# Altium project CM5IO_IARC.PrjPcb
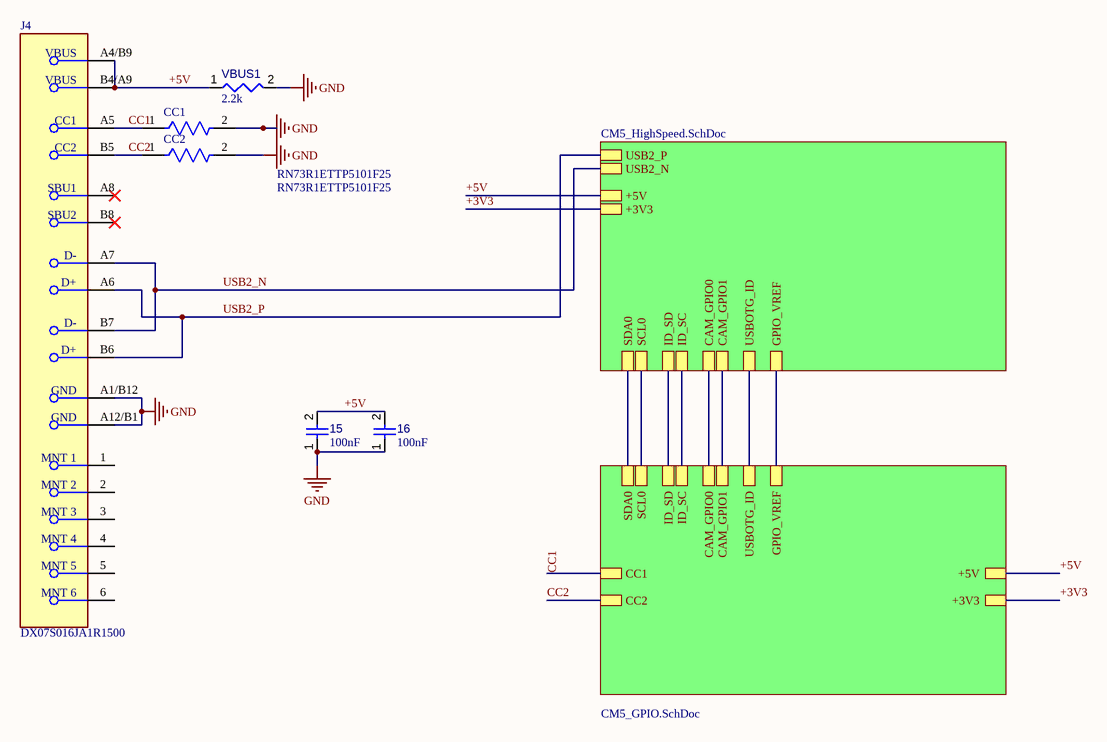
[diagram p0: Top.SchDoc]
3 sheets, 55 parts. Net scope: hierarchical (ports join the sheet entries above them; power ports are global).
Board file: CM5IO_IARC.PcbDoc
Sheets:
  Top.SchDoc
     = CM5_GPIO.SchDoc
     = CM5_HighSpeed.SchDoc

## Sheet Top.SchDoc
size A4; SheetNumber: 1; SheetTotal: 3

### Parts
15  value 100nF  [CAPC0402(1005)60_L]  (hidden comment: Capacitor 100nF +/-20% 50V 0402)
16  value 100nF  [CAPC0402(1005)60_L]  (hidden comment: Capacitor 100nF +/-20% 50V 0402)
CC1  RN73R1ETTP5101F25  [FP-RN73R1E-IPC_C]
CC2  RN73R1ETTP5101F25  [FP-RN73R1E-IPC_C]
J4  DX07S016JA1R1500  [FP-DX07S016JA1R1500-MFG]
VBUS1  value 2.2k  [RESC0402(1005)_L]  (hidden comment: 2D2KR2J)

### Sub-sheets
? = CM5_GPIO.SchDoc: SDA0, SCL0, ID_SD, ID_SC, CAM_GPIO0, CAM_GPIO1, USBOTG_ID, GPIO_VREF, +5V, +3V3, CC1, CC2
? = CM5_HighSpeed.SchDoc: USB2_P, USB2_N, +5V, +3V3, SDA0, SCL0, ID_SD, CAM_GPIO0, ID_SC, CAM_GPIO1, USBOTG_ID, GPIO_VREF

### Nets
GND: 15.1 16.1 CC1.2 CC2.2 J4.A1/B12(GND) J4.A12/B1(GND) VBUS1.2
+3V3: sheet /+3V3, sheet /+3V3
+5V: 15.2 16.2 J4.A4/B9(VBUS) J4.B4/A9(VBUS) VBUS1.1 ; sheet /+5V, sheet /+5V
CAM_GPIO0: sheet /CAM_GPIO0, sheet /CAM_GPIO0
CAM_GPIO1: sheet /CAM_GPIO1, sheet /CAM_GPIO1
CC1: CC1.1 J4.A5(CC1) ; sheet /CC1
CC2: CC2.1 J4.B5(CC2) ; sheet /CC2
GPIO_VREF: sheet /GPIO_VREF, sheet /GPIO_VREF
ID_SC: sheet /ID_SC, sheet /ID_SC
ID_SD: sheet /ID_SD, sheet /ID_SD
SCL0: sheet /SCL0, sheet /SCL0
SDA0: sheet /SDA0, sheet /SDA0
USB2_N: J4.A7(D-) J4.B7(D-) ; sheet /USB2_N
USB2_P: J4.A6(D+) J4.B6(D+) ; sheet /USB2_P
USBOTG_ID: sheet /USBOTG_ID, sheet /USBOTG_ID

Not connected (* = marked no-connect by the designer): J4 1(MNT_1) 2(MNT_2) 3(MNT_3) 4(MNT_4) 5(MNT_5) 6(MNT_6) A8(SBU1)* B8(SBU2)*

### Library data of the parts
15 16 = CMP-001-00067-3: Chip Capacitor, 100nF +/-20%, 50V, 0402, Thickness 0.6 mm; Tolerance: 10%; Min Operating Temperature: -55°C; Pins: 2; Case/Package: 0402; Max Operating Temperature: 85°C; Voltage Rating: 50V; Mounting Technology: SMT
CC1 CC2 = CMP-04015-008529-1: 5.1kΩ ±1% 0.063W, 1/16W Chip Resistor 0402 (1005 Metric) Moisture Resistant Thin Film
J4 = CMP-19038-000003-1: CONN RCP USB2.0 TYP C 24P SMD RA
VBUS1 = CMP-009-00087-2: 2K2 0.063W 5% 0402 (1005 Metric)  SMD; Power: 63mW; Mounting Technology: SMT; Tolerance: 5%; Case/Package: 0402; Pins: 2

## Sheet CM5_GPIO.SchDoc
size A4; SheetNumber: 2; SheetTotal: 3
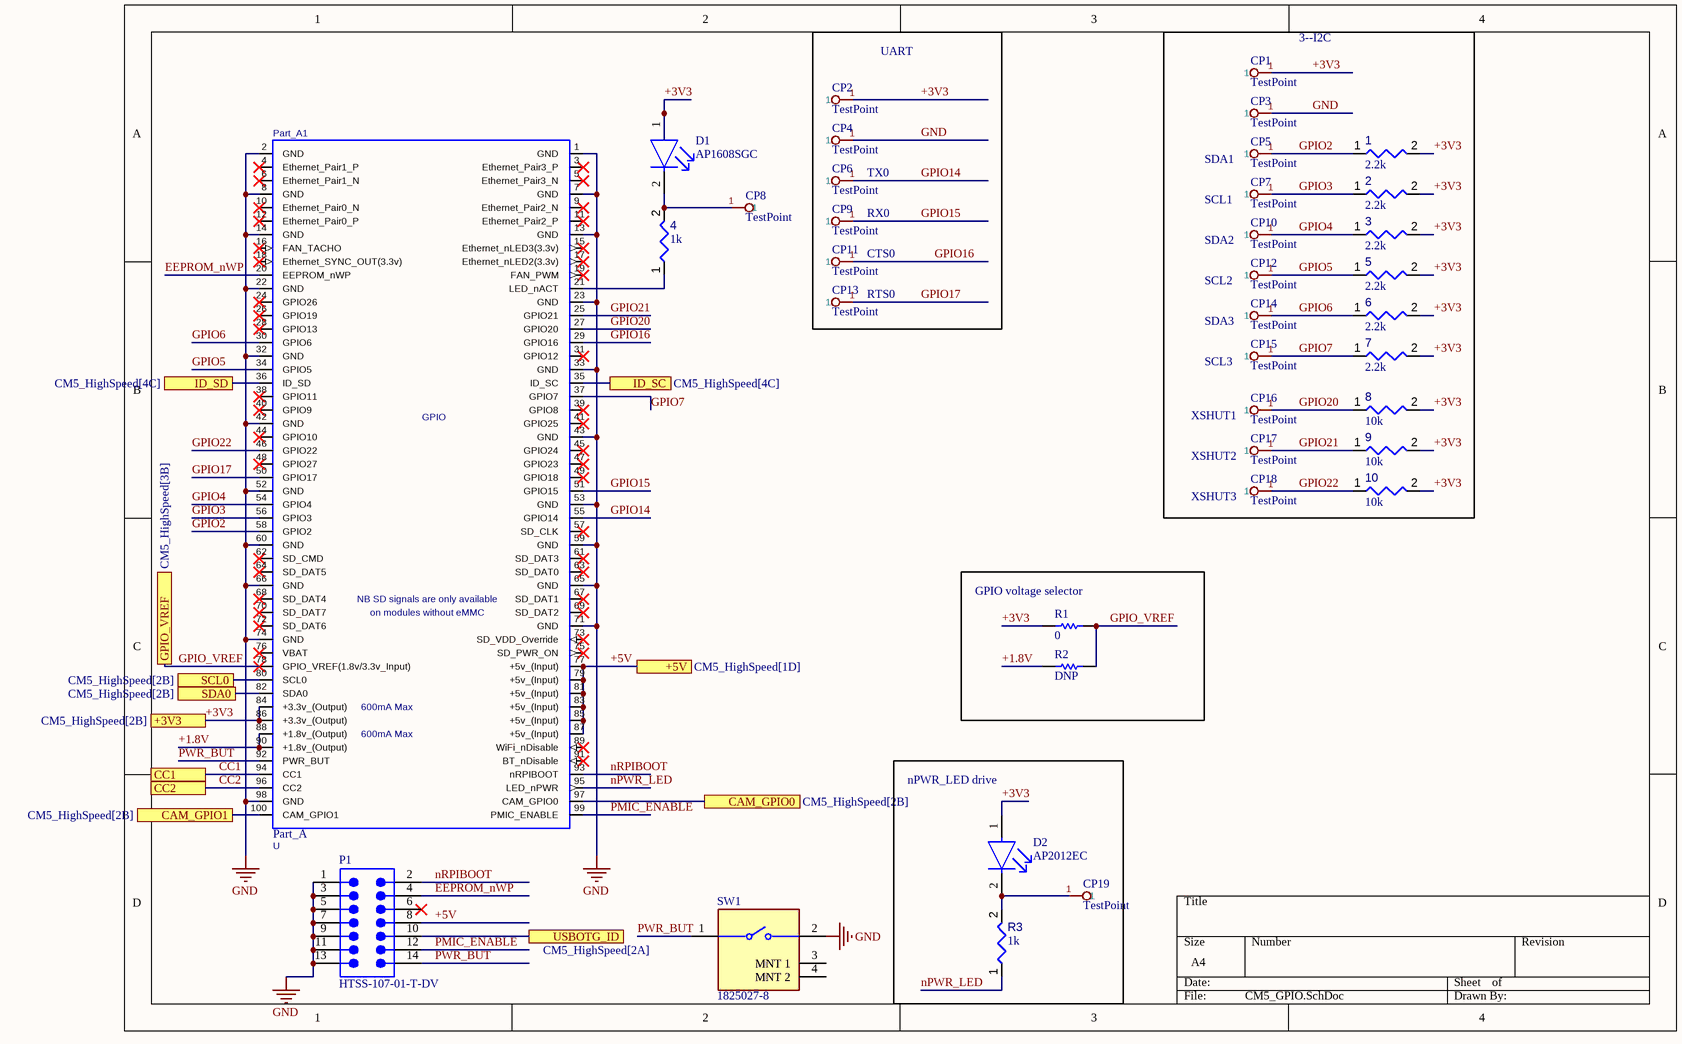
[diagram p1: CM5_GPIO.SchDoc]

### Parts
1  value 2.2k  [RESC0402(1005)_L]  (hidden comment: Resistor 2K2  +/-5 % 0402 63 mW)
2  value 2.2k  [RESC0402(1005)_L]  (hidden comment: Resistor 2K2  +/-5 % 0402 63 mW)
3  value 2.2k  [RESC0402(1005)_L]  (hidden comment: Resistor 2K2  +/-5 % 0402 63 mW)
4  value 1k  [RESC0402(1005)_L]  (hidden comment: 1KR2J)
5  value 2.2k  [RESC0402(1005)_L]  (hidden comment: Resistor 2K2  +/-5 % 0402 63 mW)
6  value 2.2k  [RESC0402(1005)_L]  (hidden comment: Resistor 2K2  +/-5 % 0402 63 mW)
7  value 2.2k  [RESC0402(1005)_L]  (hidden comment: Resistor 2K2  +/-5 % 0402 63 mW)
8  value 10k  [RESC1005X40X25ML05T05]  (hidden comment: Resistor 10k +/-1% 0402 63 mW)
9  value 10k  [RESC1005X40X25ML05T05]  (hidden comment: Resistor 10k +/-1% 0402 63 mW)
10  value 10k  [RESC1005X40X25ML05T05]  (hidden comment: Resistor 10k +/-1% 0402 63 mW)
CP1  TestPoint  [TestPoint-Footprint-1]
CP2  TestPoint  [TestPoint-Footprint-1]
CP3  TestPoint  [TestPoint-Footprint-1]
CP4  TestPoint  [TestPoint-Footprint-1]
CP5  TestPoint  [TestPoint-Footprint-1]
CP6  TestPoint  [TestPoint-Footprint-1]
CP7  TestPoint  [TestPoint-Footprint-1]
CP8  TestPoint  [TestPoint-Footprint-1]
CP9  TestPoint  [TestPoint-Footprint-1]
CP10  TestPoint  [TestPoint-Footprint-1]
CP11  TestPoint  [TestPoint-Footprint-1]
CP12  TestPoint  [TestPoint-Footprint-1]
CP13  TestPoint  [TestPoint-Footprint-1]
CP14  TestPoint  [TestPoint-Footprint-1]
CP15  TestPoint  [TestPoint-Footprint-1]
CP16  TestPoint  [TestPoint-Footprint-1]
CP17  TestPoint  [TestPoint-Footprint-1]
CP18  TestPoint  [TestPoint-Footprint-1]
CP19  TestPoint  [TestPoint-Footprint-1]
D1  AP1608SGC  [FP-AP1608SGC-MFG]
D2  AP2012EC  [FP-AP2012EC-MFG]
P1  HTSS-107-01-T-DV  [SMTC-HTSS-107-01-X-DV]
Part_A1  Part_A  Reference: U  [AMPHENOL_10164227-1004A1RLF]
R1  value 0  [RESC1005X40X25ML05T10]  (hidden comment: Resistor 0R 0402 63 mW)
R2  value DNP  [RESC1005X40X25ML05T10]  (hidden comment: Resistor 0R 0402 63 mW)
R3  value 1k  [RESC0402(1005)_L]  (hidden comment: 1KR2J)
SW1  1825027-8  [FP-1825027-8-MFG]

### Blocks framed on the sheet
GPIO voltage selector: R1 R2
nPWR_LED drive: CP19 D2 R3

### Ports
+3V3 (see CM5_HighSpeed[2B]), +5V (see CM5_HighSpeed[1D]), CAM_GPIO0 (see CM5_HighSpeed[2B]), CAM_GPIO1 (see CM5_HighSpeed[2B]), CC1, CC2, GPIO_VREF (see CM5_HighSpeed[3B]), ID_SC (see CM5_HighSpeed[4C]), ID_SD (see CM5_HighSpeed[4C]), SCL0 (see CM5_HighSpeed[2B]), SDA0 (see CM5_HighSpeed[2B]), USBOTG_ID (see CM5_HighSpeed[2A])

### Nets
GND: CP3.1 CP4.1 P1.1 P1.3 P1.5 P1.7 P1.9 P1.11 P1.13 Part_A1.1(GND) Part_A1.2(GND) Part_A1.7(GND) Part_A1.8(GND) Part_A1.13(GND) Part_A1.14(GND) Part_A1.22(GND) Part_A1.23(GND) Part_A1.32(GND) Part_A1.33(GND) Part_A1.42(GND) Part_A1.43(GND) Part_A1.52(GND) Part_A1.53(GND) Part_A1.59(GND) Part_A1.60(GND) Part_A1.65(GND) Part_A1.66(GND) Part_A1.71(GND) Part_A1.74(GND) Part_A1.98(GND) SW1.2
+1.8V: Part_A1.88(+1.8v_(Output)) Part_A1.90(+1.8v_(Output)) R2.1
+3V3: 1.2 2.2 3.2 5.2 6.2 7.2 8.2 9.2 10.2 CP1.1 CP2.1 D1.1(A) D2.1(A) Part_A1.84(+3.3v_(Output)) Part_A1.86(+3.3v_(Output)) R1.1 ; port +3V3
+5V: P1.8 Part_A1.77(+5v_(Input)) Part_A1.79(+5v_(Input)) Part_A1.81(+5v_(Input)) Part_A1.83(+5v_(Input)) Part_A1.85(+5v_(Input)) Part_A1.87(+5v_(Input)) ; port +5V
CAM_GPIO0: Part_A1.97(CAM_GPIO0) ; port CAM_GPIO0
CAM_GPIO1: Part_A1.100(CAM_GPIO1) ; port CAM_GPIO1
CC1: Part_A1.94(CC1) ; port CC1
CC2: Part_A1.96(CC2) ; port CC2
EEPROM_nWP: P1.4 Part_A1.20(EEPROM_nWP)
GPIO2: 1.1 CP5.1 Part_A1.58(GPIO2)
GPIO3: 2.1 CP7.1 Part_A1.56(GPIO3)
GPIO4: 3.1 CP10.1 Part_A1.54(GPIO4)
GPIO5: 5.1 CP12.1 Part_A1.34(GPIO5)
GPIO6: 6.1 CP14.1 Part_A1.30(GPIO6)
GPIO7: 7.1 CP15.1 Part_A1.37(GPIO7)
GPIO14: CP6.1 Part_A1.55(GPIO14)
GPIO15: CP9.1 Part_A1.51(GPIO15)
GPIO16: CP11.1 Part_A1.29(GPIO16)
GPIO17: CP13.1 Part_A1.50(GPIO17)
GPIO20: 8.1 CP16.1 Part_A1.27(GPIO20)
GPIO21: 9.1 CP17.1 Part_A1.25(GPIO21)
GPIO22: 10.1 CP18.1 Part_A1.46(GPIO22)
GPIO_VREF: Part_A1.78(GPIO_VREF(1.8v/3.3v_Input)) R1.2 R2.2 ; port GPIO_VREF
ID_SC: Part_A1.35(ID_SC) ; port ID_SC
ID_SD: Part_A1.36(ID_SD) ; port ID_SD
nPWR_LED: Part_A1.95(LED_nPWR) R3.1
nRPIBOOT: P1.2 Part_A1.93(nRPIBOOT)
PMIC_ENABLE: P1.12 Part_A1.99(PMIC_ENABLE)
PWR_BUT: P1.14 Part_A1.92(PWR_BUT) SW1.1
SCL0: Part_A1.80(SCL0) ; port SCL0
SDA0: Part_A1.82(SDA0) ; port SDA0
USBOTG_ID: P1.10 ; port USBOTG_ID
Net4_1: 4.1 Part_A1.21(LED_nACT)
Net4_2: 4.2 CP8.1 D1.2(C)
NetCP19_1: CP19.1 D2.2(C) R3.2

Not connected (* = marked no-connect by the designer): P1 6*; Part_A1 3(Ethernet_Pair3_P)* 4(Ethernet_Pair1_P)* 5(Ethernet_Pair3_N)* 6(Ethernet_Pair1_N)* 9(Ethernet_Pair2_N)* 10(Ethernet_Pair0_N)* 11(Ethernet_Pair2_P)* 12(Ethernet_Pair0_P)* 15(Ethernet_nLED3(3.3v))* 16(FAN_TACHO)* 17(Ethernet_nLED2(3.3v))* 18(Ethernet_SYNC_OUT(3.3v))* 19(FAN_PWM)* 24(GPIO26)* 26(GPIO19)* 28(GPIO13)* 31(GPIO12)* 38(GPIO11)* 39(GPIO8)* 40(GPIO9)* 41(GPIO25)* 44(GPIO10)* 45(GPIO24)* 47(GPIO23)* 48(GPIO27)* 49(GPIO18)* 57(SD_CLK)* 61(SD_DAT3)* 62(SD_CMD)* 63(SD_DAT0)* 64(SD_DAT5)* 67(SD_DAT1)* 68(SD_DAT4)* 69(SD_DAT2)* 70(SD_DAT7)* 72(SD_DAT6)* 73(SD_VDD_Override)* 75(SD_PWR_ON)* 76(VBAT)* 89(WiFi_nDisable)* 91(BT_nDisable)*; SW1 3(MNT_1) 4(MNT_2)

### Notes on the sheet
- (near CP1) 3--I2C
- UART
- TX0
- SDA1
- RX0
- SCL1
- SDA2
- CTS0
- RTS0
- SCL2
- SDA3
- (near CP15) SCL3
- XSHUT1
- XSHUT2
- (near CP18) XSHUT3
- (in symbol Part_A) GPIO; NB SD signals are only available; on modules without eMMC; 600mA Max

### Library data of the parts
1-3 5-7 = CMP-009-00166-3: Chip Resistor, 2,2 kOhms, +/-5 %, 63 mW, -55 to 155 degC, 0402; Power: 63mW; Tolerance: 5%; Pins: 2; Min Operating Temperature: -55°C; Max Operating Temperature: 155°C; Case/Package: 0402
4 R3 = CMP-009-00075-2: 1K 0.063W 5% 0402 (1005 Metric)  SMD; Power: 63mW; Pins: 2; Mounting Technology: SMT; Case/Package: 0402; Tolerance: 5%
8-10 = CMP-009-00019-5: Chip Resistor, 10 KOhm, +/- 1%, 63 mW, -55 to 155 degC, 0402 (1005 Metric); Power: 63mW; Voltage Rating: 50V; Case/Package: 0402; Mounting Technology: SM; Pins: 2; Min Operating Temperature: -55°C; Tolerance: 1%; RoHS Compliant: True; Max Operating Temperature: 155°C
CP1-CP19 = CMP-011-000005-2: Design Item ID: TestPoint; Source: CM5_GPIO.SchLib
D1 = CMP-44529-000023-1: Standard LEDs - SMD GREEN WATER CLEAR; Luminous Intensity: 15mcd; Wavelength: 568nm; Forward Voltage: 2.2V; Forward Current: 20mA; Viewing Angle: 120°; Min Operating Temperature: -40°C; Mount: Surface Mount; Case/Package: 0603; Package Quantity: 2000; Lens Style: Clear; Illumination Color: Green; Packaging: Tape and Reel; Color: Green; Lead Free: Lead Free; Lens Color: Clear; Max Operating Temperature: 85°C
D2 = CMP-44529-000070-1: LED RED CLEAR SMD; Forward Voltage: 2V; Test Current: 20mA; Luminous Intensity: 15mcd; Viewing Angle: 120°; Wavelength: 627nm; Dominant Wavelength: 625nm; Lead Free: Lead Free; Length: 2mm; Forward Current: 20mA; Mount: Surface Mount; Packaging: Tape and Reel; Illumination Color: Red; Color: Red; Height: 1.1mm; Case Code (Metric): 2012; Case Code (Imperial): 0805; Case/Package: 0805; Width: 1.25mm; RoHS Compliant: Yes; Package Quantity: 2000; Min Operating Temperature: -40°C; Max Operating Temperature: 85°C; Lens Style: Clear
P1 = CMP-1024-00046-1: Shrouded .025" SQ Post Header, Surface Mount, Vertical, -55 to 105 degC, 2.54 mm Pitch, 14-Pin, Male, RoHS; Manufacturer: Samtec; Pitch: 2.54 mm; ComponentLink1Description: Manufacturer URL; PackageReference: HTSS-107-01-X-DV; RoHS: True; Orientation: Vertical; ComponentLink2URL: http://www.samtec.com/documents/webfiles/pdf/htss.pdf; Mounting Technology: Surface Mount; PackageVersion: Z, 7/2001; Temperature Range: -55 to 105 degC; DatasheetVersion: F-214; PackageDescription: High Temp Top Shroud; ComponentLink3URL: http://www.samtec.com/documents/webfiles/cpdf/HTSS-1XX-01-XX-DV-X-XX-X-XX-MKT.pdf; ComponentLink3Description: Package Specification; PartNumber: HTSS-107-01-T-DV; ComponentLink2Description: Datasheet; ComponentLink1URL: http://www.samtec.com
R1 = CMP-009-00004-5: Chip Resistor, 0 Ohm, 0.063 W, -55 to 155 degC, 0402 (1005 Metric); Power: 63mW; Voltage Rating: 50V; Max Operating Temperature: 155°C; Pins: 2; RoHS Compliant: True; Min Operating Temperature: -55°C; Mounting Technology: SM; Case/Package: 0402
R2 = CMP-009-00004-5: Chip Resistor, 0 Ohm, 0.063 W, -55 to 155 degC, 0402 (1005 Metric); Power: 0; Voltage Rating: 50V; Max Operating Temperature: 155°C; Pins: 2; RoHS Compliant: True; Min Operating Temperature: -55°C; Mounting Technology: SM; Case/Package: 0402
SW1 = CMP-2000-05515-2: SWITCH TACTILE SPST-NO 0.05A 24V; Manufacturer: TE Connectivity; Operating Force: 1.6N; Contact Resistance: 100mΩ; Contact Current Rating: 50mA; Electromechanical Life: 100000Cycles; Temperature: -35°C to +85°C; Lead Free: Yes; Device Class L1: Electromechanical; ComponentLink2Description: Datasheet; Temperature Range Low: -35°C; Voltage Rating Dc: 24V; RoHS: TRUE; Mount: Through Hole; Temperature Range High: +85°C; Octopart: https://octopart.com/1825027-8-te+connectivity-41891101; ComponentLink2URL: https://www.te.com/commerce/DocumentDelivery/DDEController?Action=showdoc&DocId=Customer+Drawing%7F1825027%7FG4%7Fpdf%7FEnglish%7FENG_CD_1825027_G4.pdf%7F1825027-8; Manufacturer Part Number: 1825027-8; Height: 7.31mm; Automotive: No; Mouser Description: Tactile Switches R/A TACT 160G PB SWITCH; Digikey Description: SWITCH TACTILE SPST-NO 0.05A 24V; Category: Switch; Device Class L3: Pushbutton Switches; Package: 1825027-8; Device Class L2: Switches; Throw Configuration: SPST-NO

## Sheet CM5_HighSpeed.SchDoc
size A4; SheetNumber: 3; SheetTotal: 3
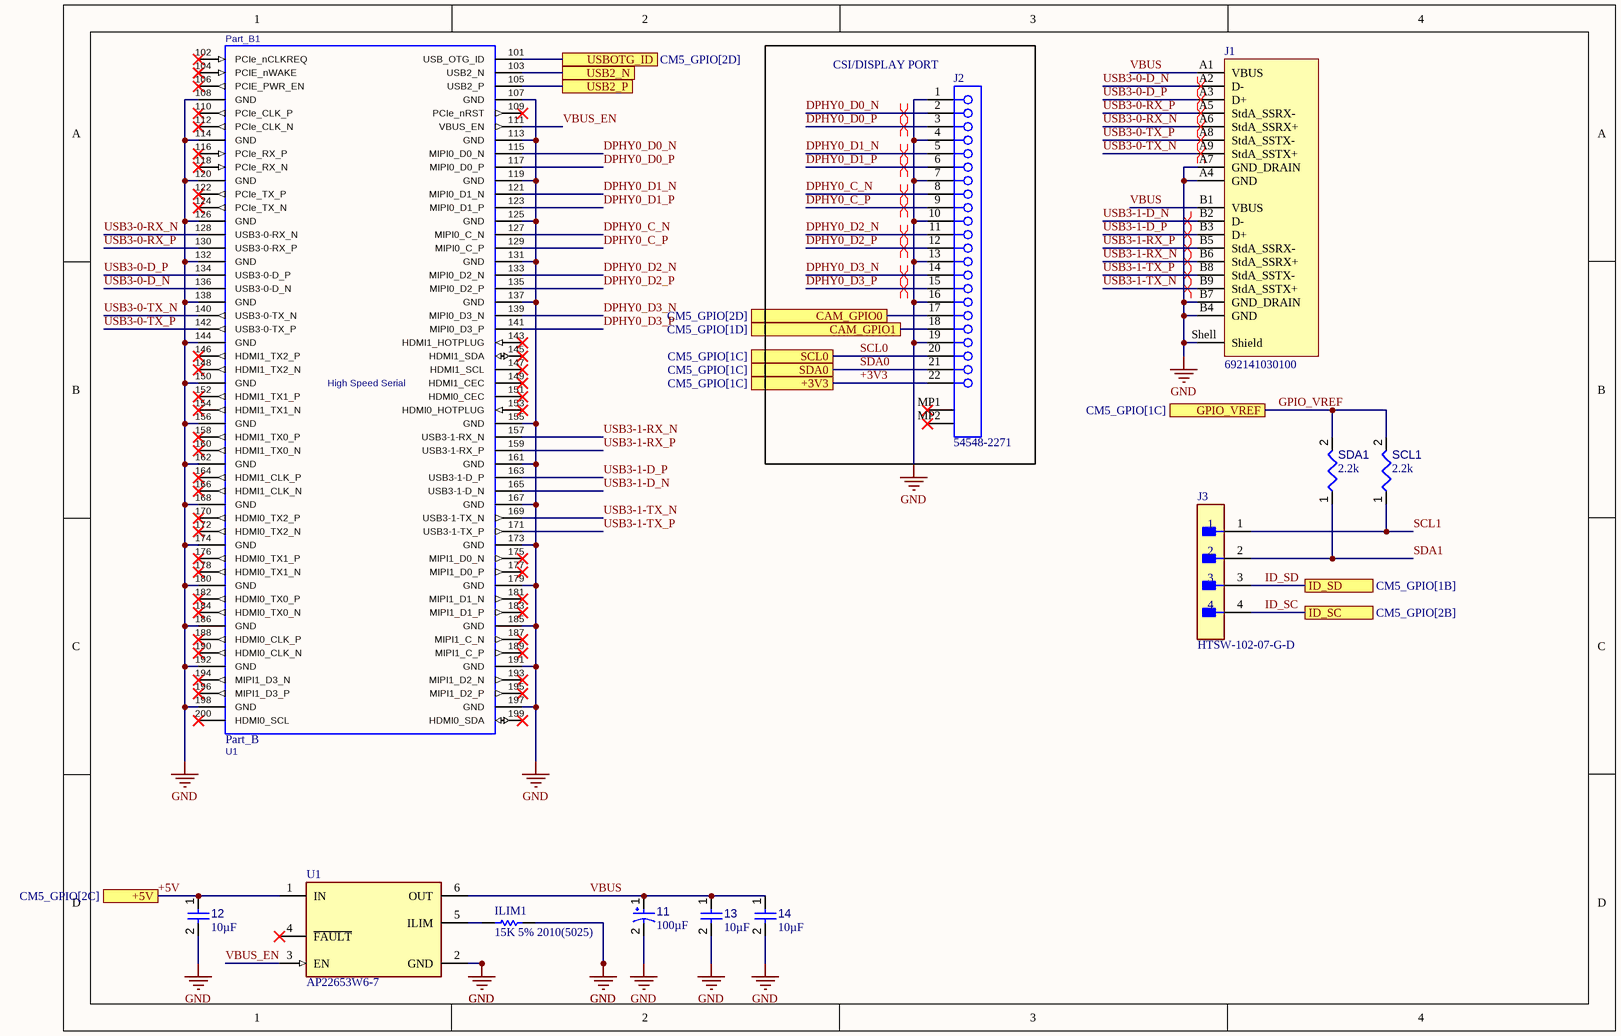
[diagram p2: CM5_HighSpeed.SchDoc]

### Parts
11  value 100µF  [AVX-TAJ-C-2_M]  (hidden comment: TAJC107K016RNJ)
12  value 10µF  [CAPC0805(2012)145_L]  (hidden comment: Capacitor 10µF +/-20% 25V 0805)
13  value 10µF  [CAPC0805(2012)145_L]  (hidden comment: Capacitor 10µF +/-20% 25V 0805)
14  value 10µF  [CAPC0805(2012)145_L]  (hidden comment: Capacitor 10µF +/-20% 25V 0805)
ILIM1  15K 5% 2010(5025)  [RESC2010(5025)_L]
J1  692141030100  [692141030100]
J2  54548-2271  [MOLX-54548-2271]
J3  HTSW-102-07-G-D  [FP-HTSW-102-07-G-D-MFG]
Part_B1  Part_B  Reference: U1  [AMPHENOL_10164227-1004A1RLF]
SCL1  value 2.2k  [RESC0402(1005)_L]  (hidden comment: Resistor 2K2  +/-5 % 0402 63 mW)
SDA1  value 2.2k  [RESC0402(1005)_L]  (hidden comment: Resistor 2K2  +/-5 % 0402 63 mW)
U1  AP22653W6-7  [FP-SOT26-MFG]

### Blocks framed on the sheet
CSI/DISPLAY PORT: J2

### Ports
+3V3 (see CM5_GPIO[1C]), +5V (see CM5_GPIO[2C]), CAM_GPIO0 (see CM5_GPIO[2D]), CAM_GPIO1 (see CM5_GPIO[1D]), GPIO_VREF (see CM5_GPIO[1C]), ID_SC (see CM5_GPIO[2B]), ID_SD (see CM5_GPIO[1B]), SCL0 (see CM5_GPIO[1C]), SDA0 (see CM5_GPIO[1C]), USB2_N, USB2_P, USBOTG_ID (see CM5_GPIO[2D])

### Nets
GND: 11.2 12.2 13.2 14.2 ILIM1.2 J1.A4(GND) J1.A7(GND_DRAIN) J1.B4(GND) J1.B7(GND_DRAIN) J1.Shell(Shield) J2.1 J2.4 J2.7 J2.10 J2.13 J2.16 J2.19 Part_B1.107(GND) Part_B1.108(GND) Part_B1.113(GND) Part_B1.114(GND) Part_B1.119(GND) Part_B1.120(GND) Part_B1.125(GND) Part_B1.126(GND) Part_B1.131(GND) Part_B1.132(GND) Part_B1.137(GND) Part_B1.138(GND) Part_B1.144(GND) Part_B1.150(GND) Part_B1.155(GND) Part_B1.156(GND) Part_B1.161(GND) Part_B1.162(GND) Part_B1.167(GND) Part_B1.168(GND) Part_B1.173(GND) Part_B1.174(GND) Part_B1.179(GND) Part_B1.180(GND) Part_B1.185(GND) Part_B1.186(GND) Part_B1.191(GND) Part_B1.192(GND) Part_B1.197(GND) Part_B1.198(GND) U1.2(GND)
+3V3: J2.22 ; port +3V3
+5V: 12.1 U1.1(IN) ; port +5V
CAM_GPIO0: J2.17 ; port CAM_GPIO0
CAM_GPIO1: J2.18 ; port CAM_GPIO1
DPHY0_C_N: J2.8 Part_B1.127(MIPI0_C_N)
DPHY0_C_P: J2.9 Part_B1.129(MIPI0_C_P)
DPHY0_D0_N: J2.2 Part_B1.115(MIPI0_D0_N)
DPHY0_D0_P: J2.3 Part_B1.117(MIPI0_D0_P)
DPHY0_D1_N: J2.5 Part_B1.121(MIPI0_D1_N)
DPHY0_D1_P: J2.6 Part_B1.123(MIPI0_D1_P)
DPHY0_D2_N: J2.11 Part_B1.133(MIPI0_D2_N)
DPHY0_D2_P: J2.12 Part_B1.135(MIPI0_D2_P)
DPHY0_D3_N: J2.14 Part_B1.139(MIPI0_D3_N)
DPHY0_D3_P: J2.15 Part_B1.141(MIPI0_D3_P)
GPIO_VREF: SCL1.2 SDA1.2 ; port GPIO_VREF
ID_SC: J3.4 ; port ID_SC
ID_SD: J3.3 ; port ID_SD
SCL0: J2.20 ; port SCL0
SCL1: J3.1 SCL1.1
SDA0: J2.21 ; port SDA0
SDA1: J3.2 SDA1.1
USB2_N: Part_B1.103(USB2_N) ; port USB2_N
USB2_P: Part_B1.105(USB2_P) ; port USB2_P
USB3-0-D_N: J1.A2(D-) Part_B1.136(USB3-0-D_N)
USB3-0-D_P: J1.A3(D+) Part_B1.134(USB3-0-D_P)
USB3-0-RX_N: J1.A6(StdA_SSRX+) Part_B1.128(USB3-0-RX_N)
USB3-0-RX_P: J1.A5(StdA_SSRX-) Part_B1.130(USB3-0-RX_P)
USB3-0-TX_N: J1.A9(StdA_SSTX+) Part_B1.140(USB3-0-TX_N)
USB3-0-TX_P: J1.A8(StdA_SSTX-) Part_B1.142(USB3-0-TX_P)
USB3-1-D_N: J1.B2(D-) Part_B1.165(USB3-1-D_N)
USB3-1-D_P: J1.B3(D+) Part_B1.163(USB3-1-D_P)
USB3-1-RX_N: J1.B6(StdA_SSRX+) Part_B1.157(USB3-1-RX_N)
USB3-1-RX_P: J1.B5(StdA_SSRX-) Part_B1.159(USB3-1-RX_P)
USB3-1-TX_N: J1.B9(StdA_SSTX+) Part_B1.169(USB3-1-TX_N)
USB3-1-TX_P: J1.B8(StdA_SSTX-) Part_B1.171(USB3-1-TX_P)
USBOTG_ID: Part_B1.101(USB_OTG_ID) ; port USBOTG_ID
VBUS: 11.1 13.1 14.1 J1.A1(VBUS) J1.B1(VBUS) U1.6(OUT)
VBUS_EN: Part_B1.111(VBUS_EN) U1.3(EN)
NetILIM1_1: ILIM1.1 U1.5(ILIM)

Not connected (* = marked no-connect by the designer): J2 MP1* MP2*; Part_B1 102(PCIe_nCLKREQ)* 104(PCIE_nWAKE)* 106(PCIE_PWR_EN)* 109(PCIe_nRST)* 110(PCIe_CLK_P)* 112(PCIe_CLK_N)* 116(PCIe_RX_P)* 118(PCIe_RX_N)* 122(PCIe_TX_P)* 124(PCIe_TX_N)* 143(HDMI1_HOTPLUG)* 145(HDMI1_SDA)* 146(HDMI1_TX2_P)* 147(HDMI1_SCL)* 148(HDMI1_TX2_N)* 149(HDMI1_CEC)* 151(HDMI0_CEC)* 152(HDMI1_TX1_P)* 153(HDMI0_HOTPLUG)* 154(HDMI1_TX1_N)* 158(HDMI1_TX0_P)* 160(HDMI1_TX0_N)* 164(HDMI1_CLK_P)* 166(HDMI1_CLK_N)* 170(HDMI0_TX2_P)* 172(HDMI0_TX2_N)* 175(MIPI1_D0_N)* 176(HDMI0_TX1_P)* 177(MIPI1_D0_P)* 178(HDMI0_TX1_N)* 181(MIPI1_D1_N)* 182(HDMI0_TX0_P)* 183(MIPI1_D1_P)* 184(HDMI0_TX0_N)* 187(MIPI1_C_N)* 188(HDMI0_CLK_P)* 189(MIPI1_C_P)* 190(HDMI0_CLK_N)* 193(MIPI1_D2_N)* 194(MIPI1_D3_N)* 195(MIPI1_D2_P)* 196(MIPI1_D3_P)* 199(HDMI0_SDA)* 200(HDMI0_SCL)*; U1 4(~{FAULT})*

### Layout directives
differential pair: DPHY0_C_N, DPHY0_C_P, DPHY0_D0_N, DPHY0_D0_P, DPHY0_D1_N, DPHY0_D1_P, DPHY0_D2_N, DPHY0_D2_P, DPHY0_D3_N, DPHY0_D3_P, USB3-0-D_N, USB3-0-D_P, USB3-0-RX_N, USB3-0-RX_P, USB3-0-TX_N, USB3-0-TX_P, USB3-1-D_N, USB3-1-D_P, USB3-1-RX_N, USB3-1-RX_P, USB3-1-TX_N, USB3-1-TX_P

### Notes on the sheet
- (in symbol Part_B) High Speed Serial

### Library data of the parts
11 = CMP-001-00046-7: Standard Tantalum, 100 uF, +/- 10%, 16 V, -55 to 125 degC, 2312 (6032 Metric), RoHS, Tape and Reel; Manufacturer: AVX; ESR: 1Ohm; Voltage Rating: 16V; Max Operating Temperature: 125°C; Package Description: 2-Pin Surface Mount Device, Body 6 x 3.25 mm; Datasheet Version: Feb-16; Packaging: TapeandReel; RoHS Compliant: True; Datasheet URL: http://datasheets.avx.com/TAJ.pdf; Case/Package: 2412; Package Quantity: 500; Package Reference: TAJ-C-2; Min Operating Temperature: -55°C; Capacitor Type: Tantalum; Resistance: 1Ohm; Tolerance: 10%; Manufacturer URL: http://www.avx.com/; Mounting Technology: SM
12-14 = CMP-001-00079-4: Chip Capacitor, 10µF +/-20%, 25V, 0805, Thickness 1.45 mm; Tolerance: 10%; Max Operating Temperature: 85°C; Case/Package: 0805; Voltage Rating: 25V; Min Operating Temperature: -55°C; Mounting Technology: SMT; Pins: 2
ILIM1 = CMP-1017-00102-1: 15K 0.75W 5% 2010 (5025 Metric)  SMD; Case-Metric: 5025; Value: 15000.00 Ohm; Case-EIA: 2010; Technology: SMT; Tolerance: 5 %; Power: 0.75 W
J1 = CMP-1502-03222-4: Wr-com, Right Angle Version 3.0; Connector, Through Hole Socket, 30 V, 250MA; Gender: Receptacle; Voltage Rating (AC): 30V; Number of Ports: 2; Connector Type: USB; USB Standard: USB 3.0; Contact Resistance: 50mΩ; Insulation Resistance: 100MΩ; Number of Contacts: 18; Min Operating Temperature: -40°C; REACH SVHC: Unknown; Features: Shielded; Contact Plating: Gold; Max Operating Temperature: 85°C; Current Rating: 250mA; Length: 15.59mm; Orientation: Right Angle; Voltage Rating: 30V; Contact Material: Gold, Nickel; Operating Supply Voltage: 30V; Lead Free: Lead Free; Termination: Through Hole; Number of Pins: 18; Mount: Horizontal, Through Hole; Color: Blue; Flammability Rating: UL94 V-0; Height: 16.335mm; Width: 19.7mm; RoHS: Compliant
J2 = CMP-1241-00555-1: 0.5 mm Pitch Easy-On(TM) Type FPC Connector, 1.2 mm Mated Height, Right Angle, ZIF, SMT, Bottom Contact, 22 Circuits, -20 to 85 degC, ELV and RoHS Compliant, Tape and Reel; Manufacturer: Molex; Circuits (Loaded): 22; Stackable: No; Material - Plating Termination: Tin; PCB Retention: Yes; Entry Angle: 90degrees Angle; Material - Plating Mating: Gold; Current (Max per Contact): 0.5A; Material - Metal: Phosphor Bronze; Voltage (Max): 50V; Mated Height: 1.20mm; Pitch - Mating Interface: 0.50mm; Durability (mating cycles max): 20; PackageVersion: Rev. N, 06/2008; PackageDescription: 22-Lead FPC Connector, Pitch 0.5 mm; PackageReference: 54548-2271; ComponentLink2Description: Datasheet; PartNumber: 54548-2271; ComponentLink3URL: http://www.molex.com/pdm_docs/sd/545482171_sd.pdf; Contact Position: Bottom; Packing: Tape and Reel; ComponentLink1URL: http://www.molex.com/molex/index.jsp; Mounting Technology: Surface Mount; ComponentLink3Description: Package Specification; PCB Locator: No; ComponentLink2URL: http://www.molex.com/webdocs/datasheets/pdf/en-us/0545482271_FFC_FPC_CONNECTORS.pdf; Orientation: Right Angle; Number of Rows: 1; RoHS: TRUE; Polarized to PCB: Yes; ComponentLink1Description: Manufacturer URL
J3 = CMP-02766-000010-1: CONN HEADER VERT 4POS 2.54MM; Manufacturer: Samtec; Voltage Rating: 550V; Conn Orientation: Straight; Number Of Contacts: 4; Conn Gender: Male; Current Rating: 6.3A; Number Of Rows: 2; Category: Conn; Temperature: -55°C to +125°C; Automotive: No; Digikey Description: CONN HEADER VERT 4POS 2.54MM; ComponentLink2URL: http://suddendocs.samtec.com/catalog_english/htsw_th.pdf; Device Class L2: Headers and Wire Housings; Mouser Description: Conn Unshrouded Header HDR 4 POS 2.54mm Solder ST Thru-Hole Bag; Manufacturer Part Number: HTSW-102-07-G-D; Temperature Range High: +125°C; Contact Material: Gold,Nickel; Temperature Range Low: -55°C; ComponentLink2Description: Datasheet; Device Class L1: Connectors; Pitch: 2.54mm; Octopart: https://octopart.com/htsw-102-07-g-d-samtec-10531767; RoHS: TRUE; Package: HTSW-102-07-G-D; Lead Free: Yes; Device Class L3: unset; Height: 8.71mm
Part_B1 = Part_B: pin to pad: 101>1 102>2 103>3 104>4 105>5 106>6 107>7 108>8 109>9 110>10 111>11 112>12 113>13 114>14 115>15 116>16 117>17 118>18 119>19 120>20 121>21 122>22 123>23 124>24 125>25 126>26 127>27 128>28 129>29 130>30 131>31 132>32 133>33 134>34 135>35 136>36 137>37 138>38 139>39 140>40 141>41 142>42 143>43 144>44 145>45 146>46 147>47 148>48 149>49 150>50 151>51 152>52 153>53 154>54 155>55 156>56 157>57 158>58 159>59 160>60 161>61 162>62 163>63 164>64 165>65 166>66 167>67 168>68 169>69 170>70 171>71 172>72 173>73 174>74 175>75 176>76 177>77 178>78 179>79 180>80 181>81 182>82 183>83 184>84 185>85 186>86 187>87 188>88 189>89 190>90 191>91 192>92 193>93 194>94 195>95 196>96 197>97 198>98 199>99 200>100
SCL1 SDA1 = CMP-009-00166-3: as 1 on sheet CM5_GPIO; Pins: 2; Min Operating Temperature: -55°C; Max Operating Temperature: 155°C; Case/Package: 0402
U1 = CMP-12749-000002-1: LOAD SWITCH,SOT26,T&R,3K

## Nets that join several sheets
GND: Top (7 pins), CM5_GPIO (31 pins), CM5_HighSpeed (48 pins)
+3V3: CM5_GPIO (16 pins), CM5_HighSpeed (J2.22)
+5V: Top (5 pins), CM5_GPIO (7 pins), CM5_HighSpeed (12.1 U1.1)
CAM_GPIO0: CM5_GPIO (Part_A1.97), CM5_HighSpeed (J2.17)
CAM_GPIO1: CM5_GPIO (Part_A1.100), CM5_HighSpeed (J2.18)
CC1: Top (CC1.1 J4.A5), CM5_GPIO (Part_A1.94)
CC2: Top (CC2.1 J4.B5), CM5_GPIO (Part_A1.96)
GPIO_VREF: CM5_GPIO (Part_A1.78 R1.2 R2.2), CM5_HighSpeed (SCL1.2 SDA1.2)
ID_SC: CM5_GPIO (Part_A1.35), CM5_HighSpeed (J3.4)
ID_SD: CM5_GPIO (Part_A1.36), CM5_HighSpeed (J3.3)
SCL0: CM5_GPIO (Part_A1.80), CM5_HighSpeed (J2.20)
SDA0: CM5_GPIO (Part_A1.82), CM5_HighSpeed (J2.21)
USB2_N: Top (J4.A7 J4.B7), CM5_HighSpeed (Part_B1.103)
USB2_P: Top (J4.A6 J4.B6), CM5_HighSpeed (Part_B1.105)
USBOTG_ID: CM5_GPIO (P1.10), CM5_HighSpeed (Part_B1.101)